# Altium project HALF_BRIDGE.PrjPCB
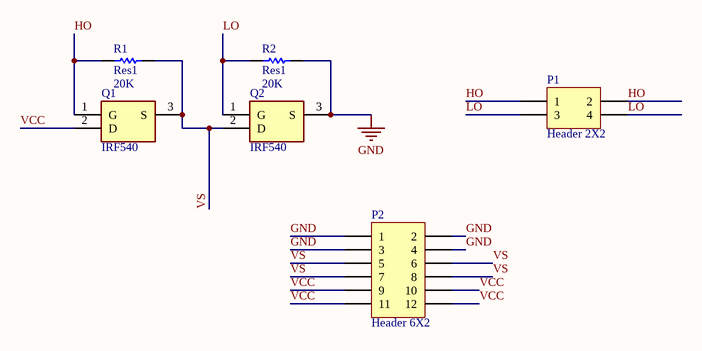
[diagram p0: HALF_BRIDGE.SchDoc]
1 sheet, 6 parts. Net scope: global (net labels, ports and power ports of the same name join across sheets).
Board file: HALF_BRIDGE.PcbDoc

## Sheet HALF_BRIDGE.SchDoc
size A4

### Parts
P1  Header 2X2  [HDR2X2]
P2  Header 6X2  [HDR2X6]
Q1  IRF540  [TO254P465X1024X2050-3P]
Q2  IRF540  [TO254P465X1024X2050-3P]
R1  Res1  value 20K  [AXIAL-0.3]
R2  Res1  value 20K  [AXIAL-0.3]

### Nets
GND: P2.1 P2.2 P2.3 P2.4 Q2.3(S) R2.2
HO: P1.1 P1.2 Q1.1(G) R1.1
LO: P1.3 P1.4 Q2.1(G) R2.1
VCC: P2.9 P2.10 P2.11 P2.12 Q1.2(D)
VS: P2.5 P2.6 P2.7 P2.8 Q1.3(S) Q2.2(D) R1.2

### Library data of the parts
P1 = Header 2X2: Header, 2-Pin, Dual row; LatestRevisionDate: 17-Jul-2002; LatestRevisionNote: Re-released for DXP Platform.; Publisher: Altium Limited
P2 = Header 6X2: Header, 6-Pin, Dual row; LatestRevisionDate: 17-Jul-2002; LatestRevisionNote: Re-released for DXP Platform.; Publisher: Altium Limited
Q1 Q2 = IRF540: Transistor; Manufacturer_Name: Vishay; Allied_Number: 70459367; Datasheet Link: http://www.vishay.com/docs/91021/91021.pdf; Height: 4.65mm; Manufacturer_Part_Number: IRF540; Mouser Part Number: 844-IRF540; Mouser Price/Stock: https://www.mouser.com/Search/Refine.aspx?Keyword=844-IRF540; RS Part Number: 3683254; RS Price/Stock: http://uk.rs-online.com/web/p/products/3683254; Allied Price/Stock: https://www.alliedelec.com/siliconix-vishay-irf540/70459367/
R1 R2 = Res1: Resistor; Published: 8-Jun-2000; LatestRevisionDate: 17-Jul-2002; LatestRevisionNote: Re-released for DXP Platform.; PackageReference: AXIAL-0.3; Publisher: Altium Limited; PackageDescription: Axial Device, Thru-Hole; 2 Leads; 0.3 in Pin Spacing